# Altium schematic sheet LCD_Display.SchDoc
size A
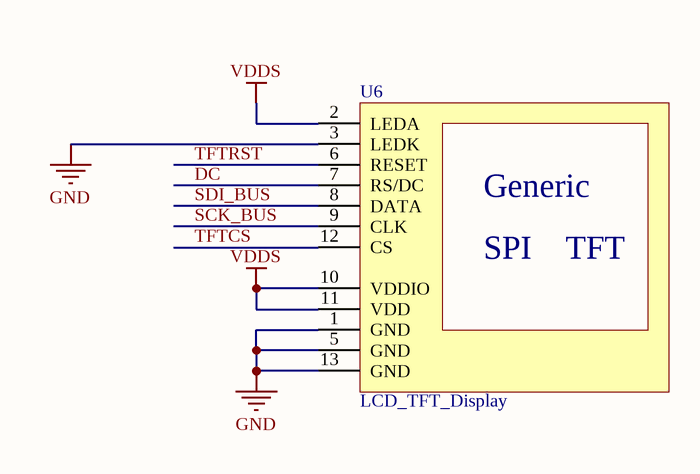
[diagram p0: LCD_Display.SchDoc]

## Parts
U6  LCD_TFT_Display  [LCD_Ribbon]

## Nets
GND: U6.1(GND) U6.3(LEDK) U6.5(GND) U6.13(GND)
VDDS: U6.2(LEDA) U6.10(VDDIO) U6.11(VDD)
DC: U6.7(RS/DC)
SCK_BUS: U6.9(CLK)
SDI_BUS: U6.8(DATA)
~{TFTRST}: U6.6(RESET)
TFTCS: U6.12(CS)

## Notes on the sheet
- (in symbol LCD_TFT_Display) Generic; SPI    TFT